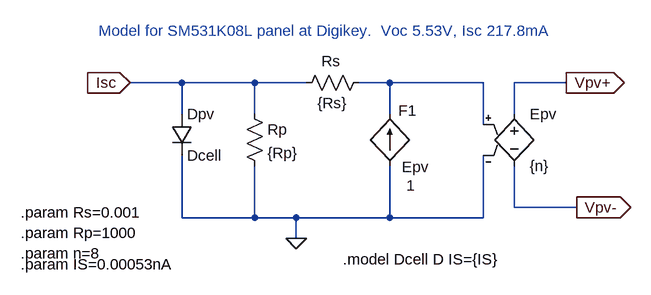
[diagram p0: schematic SolarPanel.asc]
SolarPanel.asc, the LTspice schematic file:
Version 4
SHEET 1 880 680
WIRE 96 96 16 96
WIRE 208 96 96 96
WIRE 288 96 208 96
WIRE 416 96 368 96
WIRE 560 96 416 96
WIRE 688 96 608 96
WIRE 96 144 96 96
WIRE 208 144 208 96
WIRE 416 144 416 96
WIRE 608 144 608 96
WIRE 560 160 560 96
WIRE 608 288 608 224
WIRE 704 288 608 288
WIRE 96 304 96 208
WIRE 208 304 208 224
WIRE 208 304 96 304
WIRE 272 304 208 304
WIRE 416 304 416 224
WIRE 416 304 272 304
WIRE 560 304 560 208
WIRE 560 304 416 304
WIRE 272 336 272 304
FLAG 272 336 0
FLAG 16 96 Isc
IOPIN 16 96 In
FLAG 688 96 Vpv+
IOPIN 688 96 Out
FLAG 704 288 Vpv-
IOPIN 704 288 Out
SYMBOL diode 80 144 R0
SYMATTR InstName Dpv
SYMATTR Value Dcell
SYMBOL res 192 128 R0
SYMATTR InstName Rp
SYMATTR Value {Rp}
SYMBOL res 384 80 R90
WINDOW 0 -2 58 VBottom 2
WINDOW 3 32 56 VTop 2
SYMATTR InstName Rs
SYMATTR Value {Rs}
SYMBOL e 608 128 R0
SYMATTR InstName Epv
SYMATTR Value {n}
SYMBOL f 416 224 R180
WINDOW 0 -42 85 Left 2
WINDOW 3 -60 -2 Left 2
WINDOW 123 -39 -30 Left 2
SYMATTR InstName F1
SYMATTR Value Epv
SYMATTR Value2 1
TEXT 344 368 Left 2 !.model Dcell D IS={IS}
TEXT -152 296 Left 2 !.param Rs=0.001\n.param Rp=1000\n.param n=8
TEXT -152 376 Left 2 !.param IS=0.00053nA
TEXT -32 16 Left 2 ;Model for SM531K08L panel at Digikey.  Voc 5.53V, Isc 217.8mA

The netlist it stands for:
* SolarPanel.asc
Dpv Isc 0 Dcell
Rp Isc 0 {Rp}
Rs N001 Isc {Rs}
Epv Vpv+ Vpv- N001 0 {n}
F1 0 N001 Epv 1
.model D D
.lib standard.dio
.model Dcell D IS={IS}
.param Rs=0.001
.param Rp=1000
.param n=8
.param IS=0.00053nA
* Model for SM531K08L panel at Digikey.  Voc 5.53V, Isc 217.8mA
.backanno
.end